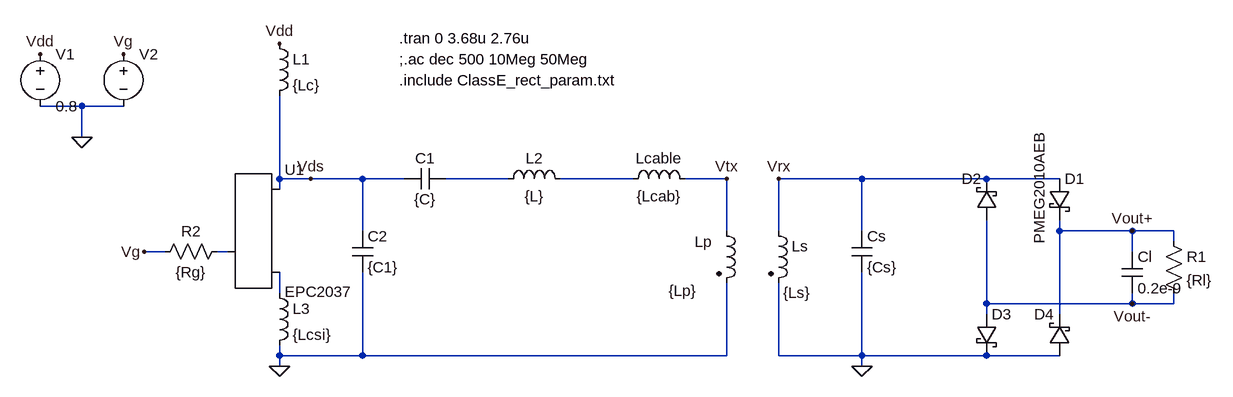
[diagram p0: schematic ClassE_v3.asc]
ClassE_v3.asc, the LTspice schematic file:
Version 4
SHEET 1 1488 680
WIRE -832 -32 -896 -32
WIRE -768 -32 -832 -32
WIRE -832 16 -832 -32
WIRE -528 80 -528 -48
WIRE -480 80 -528 80
WIRE -400 80 -480 80
WIRE -336 80 -400 80
WIRE -176 80 -272 80
WIRE 16 80 -96 80
WIRE 160 80 96 80
WIRE 368 80 240 80
WIRE 560 80 368 80
WIRE 672 80 560 80
WIRE -528 96 -528 80
WIRE -400 160 -400 80
WIRE 160 160 160 80
WIRE 240 160 240 80
WIRE 368 160 368 80
WIRE 672 160 672 144
WIRE 784 160 672 160
WIRE 848 160 784 160
WIRE 848 176 848 160
WIRE -704 192 -736 192
WIRE -608 192 -624 192
WIRE 784 192 784 160
WIRE -528 256 -528 224
WIRE 560 272 560 144
WIRE 784 272 784 256
WIRE 784 272 560 272
WIRE 848 272 848 256
WIRE 848 272 784 272
WIRE 560 288 560 272
WIRE 672 288 672 160
WIRE -528 352 -528 336
WIRE -400 352 -400 224
WIRE -400 352 -528 352
WIRE 160 352 160 240
WIRE 160 352 -400 352
WIRE 240 352 240 240
WIRE 368 352 368 224
WIRE 368 352 240 352
WIRE 560 352 368 352
WIRE 672 352 560 352
WIRE -528 368 -528 352
WIRE 368 368 368 352
FLAG -832 16 0
FLAG -768 -112 Vg
FLAG -528 -128 Vdd
FLAG -736 192 Vg
FLAG 160 80 Vtx
FLAG -528 368 0
FLAG 368 368 0
FLAG 784 160 Vout+
FLAG -480 80 Vds
FLAG -896 -112 Vdd
FLAG 240 80 Vrx
FLAG 784 272 Vout-
SYMBOL voltage -768 -128 R0
WINDOW 3 24 96 Invisible 2
SYMATTR Value PULSE(0 3 0 0.1n 0.1n 18.3n 36.873n)
SYMATTR Value2 AC 1
SYMATTR SpiceLine Rser=20
SYMATTR InstName V2
SYMBOL EPCGaN -608 192 R0
SYMATTR InstName U1
SYMATTR Value EPC2037
SYMBOL ind -544 -144 R0
SYMATTR InstName L1
SYMATTR Value {Lc}
SYMATTR SpiceLine Rser=0.4 Cpar=0.25p
SYMBOL ind -192 96 R270
WINDOW 0 32 56 VTop 2
WINDOW 3 5 56 VBottom 2
SYMATTR InstName L2
SYMATTR Value {L}
SYMATTR SpiceLine Rser=0.8
SYMBOL cap -272 64 R90
WINDOW 0 0 32 VBottom 2
WINDOW 3 32 32 VTop 2
SYMATTR InstName C1
SYMATTR Value {C}
SYMATTR SpiceLine Rser=0.1
SYMBOL res 832 160 R0
SYMATTR InstName R1
SYMATTR Value {Rl}
SYMBOL cap -416 160 R0
SYMATTR InstName C2
SYMATTR Value {C1}
SYMATTR SpiceLine Rser=0.1
SYMBOL res -608 176 R90
WINDOW 0 0 56 VBottom 2
WINDOW 3 32 56 VTop 2
SYMATTR InstName R2
SYMATTR Value {Rg}
SYMBOL ind2 144 144 R0
WINDOW 0 -33 33 Left 2
WINDOW 3 -73 108 Left 2
SYMATTR InstName Lp
SYMATTR Value {Lp}
SYMATTR Type ind
SYMATTR SpiceLine Rser={Rp}
SYMBOL ind2 224 144 R0
WINDOW 3 23 111 Left 2
SYMATTR Value {Ls}
SYMATTR InstName Ls
SYMATTR Type ind
SYMATTR SpiceLine Rser={Rs}
SYMBOL cap 352 160 R0
SYMATTR InstName Cs
SYMATTR Value {Cs}
SYMBOL ind -544 240 R0
SYMATTR InstName L3
SYMATTR Value {Lcsi}
SYMATTR SpiceLine Rser=0.1
SYMBOL voltage -896 -128 R0
WINDOW 123 0 0 Left 0
WINDOW 39 0 0 Left 0
SYMATTR InstName V1
SYMATTR Value 0.8
SYMBOL ind 0 96 R270
WINDOW 0 32 56 VTop 2
WINDOW 3 5 56 VBottom 2
SYMATTR InstName Lcable
SYMATTR Value {Lcab}
SYMATTR SpiceLine Rser={Rcab}
SYMBOL schottky 656 80 R0
WINDOW 3 -15 100 VLeft 2
SYMATTR Value PMEG2010AEB
SYMATTR InstName D1
SYMATTR Description Diode
SYMATTR Type diode
SYMBOL schottky 576 144 R180
WINDOW 0 24 64 Left 2
WINDOW 3 24 0 Invisible 2
SYMATTR InstName D2
SYMATTR Value PMEG2010AEB
SYMATTR Description Diode
SYMATTR Type diode
SYMBOL schottky 544 288 R0
WINDOW 3 24 36 Invisible 2
SYMATTR Value PMEG2010AEB
SYMATTR InstName D3
SYMATTR Description Diode
SYMATTR Type diode
SYMBOL schottky 688 352 R180
WINDOW 0 24 64 Left 2
WINDOW 3 24 0 Invisible 2
SYMATTR InstName D4
SYMATTR Value PMEG2010AEB
SYMATTR Description Diode
SYMATTR Type diode
SYMBOL cap 768 192 R0
SYMATTR InstName Cl
SYMATTR Value 0.2e-9
TEXT -344 -72 Left 2 !.include ClassE_rect_param.txt
TEXT -344 -136 Left 2 !.tran 0 3.68u 2.76u
TEXT -344 -104 Left 2 !;.ac dec 500 10Meg 50Meg

The netlist it stands for:
* ClassE_v3.asc
V2 Vg 0 PULSE(0 3 0 0.1n 0.1n 18.3n 36.873n) AC 1 Rser=20
XU1 N003 Vds N004 EPC2037
L1 Vdd Vds {Lc} Rser=0.4 Cpar=0.25p
L2 N001 N002 {L} Rser=0.8
C1 N001 Vds {C} Rser=0.1
R1 Vout+ Vout- {Rl}
C2 Vds 0 {C1} Rser=0.1
R2 N003 Vg {Rg}
Lp Vtx 0 {Lp} Rser={Rp}
Ls Vrx 0 {Ls} Rser={Rs}
Cs Vrx 0 {Cs}
L3 N004 0 {Lcsi} Rser=0.1
V1 Vdd 0 0.8
Lcable N002 Vtx {Lcab} Rser={Rcab}
D1 Vrx Vout+ PMEG2010AEB
D2 Vout- Vrx PMEG2010AEB
D3 Vout- 0 PMEG2010AEB
D4 0 Vout+ PMEG2010AEB
Cl Vout+ Vout- 0.2e-9
.model D D
.lib standard.dio
.include ClassE_rect_param.txt
.tran 0 3.68u 2.76u
;.ac dec 500 10Meg 50Meg
.backanno
.end